# Altium schematic sheet light_sensor.SchDoc
size A4
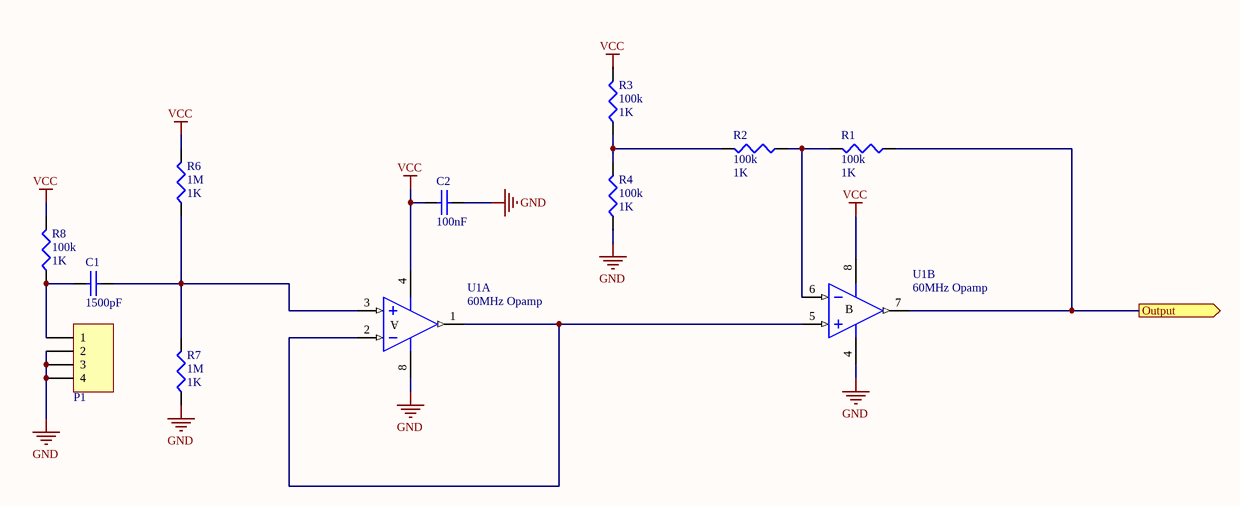
[diagram p0: light_sensor.SchDoc]

## Parts
C1  1500pF  [ECE-CAPC1608-0603SM]
C2  100nF  [ECE-CAPC1608-0603SM]
P1  Phototransistor  [ECE-600104STTH]  (value not drawn)
R1  100k  value 1K  [J1-0603]
R2  100k  value 1K  [J1-0603]
R3  100k  value 1K  [J1-0603]
R4  100k  value 1K  [J1-0603]
R6  1M  value 1K  [J1-0603]
R7  1M  value 1K  [J1-0603]
R8  100k  value 1K  [J1-0603]
U1  60MHz Opamp  [SO-8]  (parts A,B of 2)

## Ports
Output (out)

## Nets
GND: C2.2 P1.2 P1.3 P1.4 R4.1 R7.1 U1.4(V-) U1.8(V+)
VCC: C2.1 R3.2 R6.2 R8.2 U1.4(V-) U1.8(V+)
Output: R1.1 U1.7(OUT) ; port Output
NetC1_1: C1.1 R6.1 R7.2 U1.3(IN+)
NetC1_2: C1.2 P1.1 R8.1
NetR1_2: R1.2 R2.1 U1.6(IN-)
NetR2_2: R2.2 R3.1 R4.2
NetU1_1: U1.1(OUT) U1.2(IN-) U1.5(IN+)

## Notes on the sheet
- (in symbol LT6221, part A) A
- (in symbol LT6221, part B) B

## Library data of the parts
C1 = CAP000613: CAP CER 1500pF 50V X7R SM0603; Manufactuer: Samsung; Manufacturer-PN: CL10B152KB8SFNC; Assembly Method: Surface Mount; Item Type: Item; Path: ece/ts/Lists/Stock Inventory; Value: 1500pF; UoA Stock#: CAP000613; Size/Package: 0603 (1608 Metric); Voltage/Current: 50V; Supplier1: Digikey; Supplier1-PN: 1276-1960-2-ND; Component Type: CAP-0603-1.5nF; Category: Capacitor; Status: Active
C2 = CAP000624: CAP CER 100nF 25V X7R SM0603; Manufactuer: Kemet; Manufacturer-PN: C0603C104K3RACTU; Assembly Method: Surface Mount; Item Type: Item; Path: ece/ts/Lists/Stock Inventory; Value: 100nF; UoA Stock#: CAP000624; Size/Package: 0603 (1608 Metric); Voltage/Current: 25V; Supplier1: Digikey; Supplier1-PN: 399-1281-2-ND; Component Type: CAP-0603-100nF; Category: Capacitor; Status: Active
P1 = CON000003: HEADER POLARISED 4WAY TH; Manufactuer: GTK; Manufacturer-PN: 600104ST; Assembly Method: Through hole; Item Type: Item; Path: ece/ts/Lists/Stock Inventory; UoA Stock#: CON000003; Value: 4 Way; Size/Package: 2.54 Radial; Datasheet Link: http://share.engineering.auckland.ac.nz/ece/ts/Student%20Documents/polarised_connectors.pdf; Supplier1: Elecon; Supplier1-PN: YY3N04; Supplier2: Active Components; Supplier2-PN: 600104ST; Component Type: NA; Category: Connector; Status: Active
R1-R4 R6-R8 = Res3: Resistor; Published: 8-Jun-2000; LatestRevisionDate: 29-May-2009; LatestRevisionNote: IPC-7351 Footprint Added.; PackageReference: J1-0603; Publisher: Altium Limited; PackageDescription: Chip Resistor
U1 = LT6221